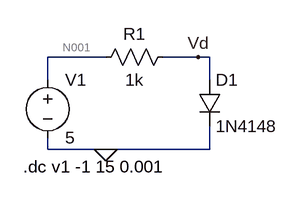
[diagram p0: schematic Draft4.asc]
Draft4.asc, the LTspice schematic file:
Version 4
SHEET 1 880 680
WIRE 160 -64 80 -64
WIRE 288 -64 240 -64
WIRE 304 -64 288 -64
WIRE 80 -32 80 -64
WIRE 304 -32 304 -64
WIRE 80 64 80 48
WIRE 160 64 80 64
WIRE 304 64 304 32
WIRE 304 64 160 64
FLAG 160 64 0
FLAG 288 -64 Vd
SYMBOL voltage 80 -48 R0
WINDOW 123 0 0 Left 0
WINDOW 39 0 0 Left 0
SYMATTR InstName V1
SYMATTR Value 5
SYMBOL res 256 -80 R90
WINDOW 0 0 56 VBottom 2
WINDOW 3 32 56 VTop 2
SYMATTR InstName R1
SYMATTR Value 1k
SYMBOL diode 288 -32 R0
SYMATTR InstName D1
SYMATTR Value 1N4148
TEXT 46 88 Left 2 !.dc v1 -1 15 0.001

The netlist it stands for:
* Draft4.asc
V1 N001 0 5
R1 Vd N001 1k
D1 Vd 0 1N4148
.model D D
.lib standard.dio
.dc v1 -1 15 0.001
.backanno
.end

* Results of the author's LTspice run, read from the files saved beside the schematic
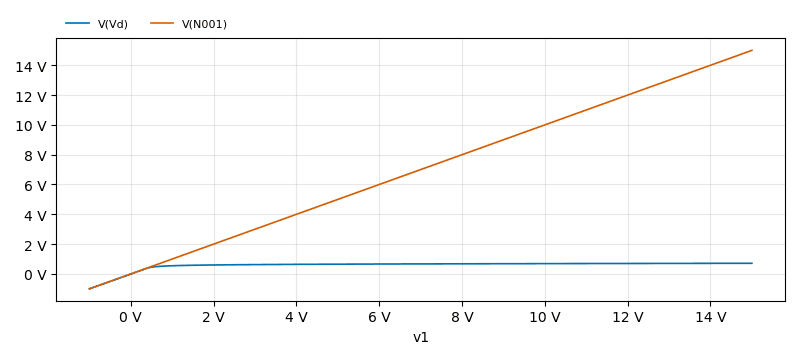
[diagram p1: DC transfer characteristic of Draft4.asc, plotted from the saved traces]
* DC transfer characteristic, 1 run:
*   V(Vd): -1 V at v1=-1 V, 712.8 mV at v1=15 V, min -1 V, max 712.8 mV
*   V(N001): -1 V at v1=-1 V, 15 V at v1=15 V, min -1 V, max 15 V